# Altium schematic sheet USB3.0_Arria10.SchDoc: USB3.0
size B; DocumentNumber: 28; SheetNumber: 28; SheetTotal: 46
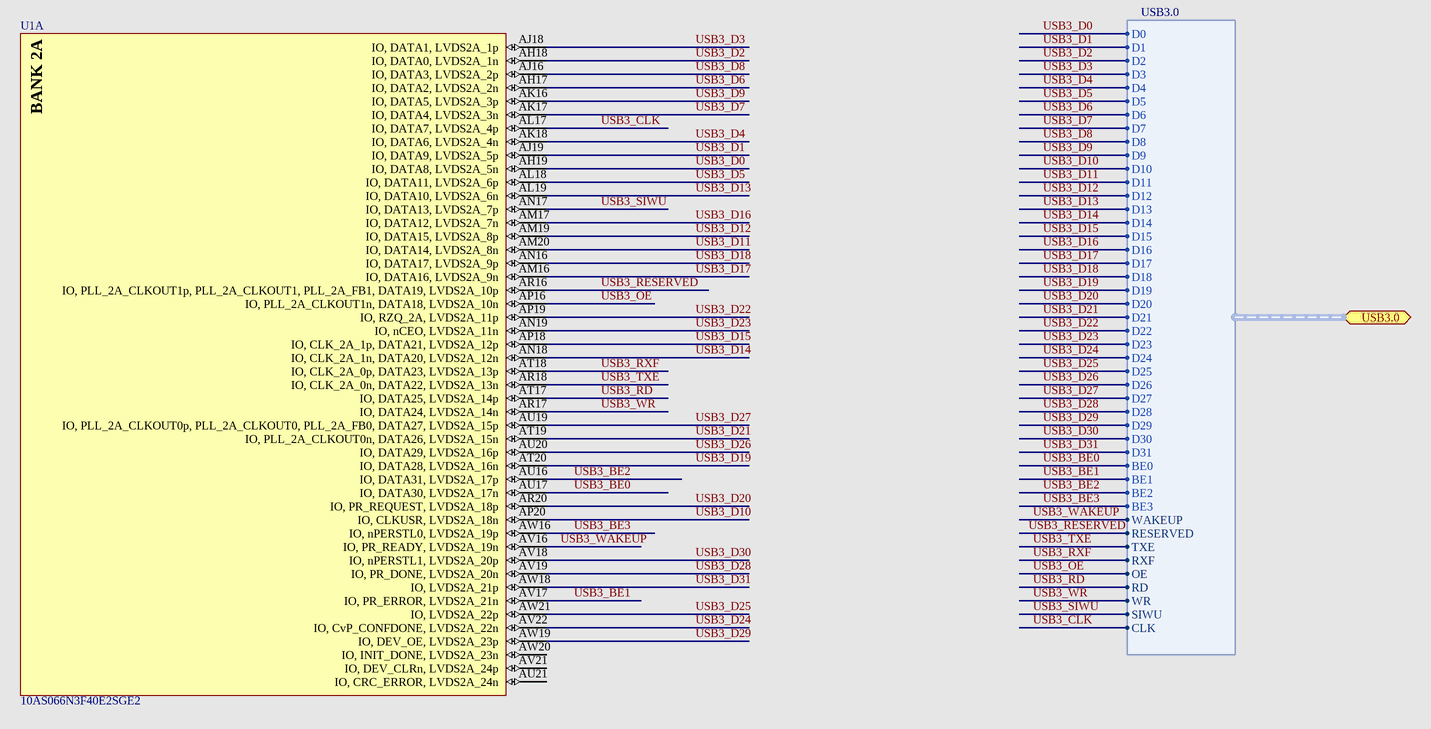
[diagram p0: USB3.0_Arria10.SchDoc]

## Parts
U1  10AS066N3F40E2SGE2  [ALTR-FBGA1517_A-350]  (part A of 31)

## Ports
USB3.0 (harness USB3.0)

## Harnesses
USB3.0: RD, OE, RXF, TXE, RESERVED, WAKEUP, WR, SIWU, CLK, D0, D1, D2, D3, D4, D5, D6, D7, D8, D9, D10, D11, D12, D13, D14, D15, D16, D17, D18, D19, D20, D21, D22, D23, D24, D25, D26, D27, D28, D29, D30, D31, BE0, BE1, BE2, BE3

## Nets
USB3_BE0: U1.AU17(IO,_DATA30,_LVDS2A_17n) ; port USB3.0.BE0
USB3_BE1: U1.AV17(IO,_PR_ERROR,_LVDS2A_21n) ; port USB3.0.BE1
USB3_BE2: U1.AU16(IO,_DATA31,_LVDS2A_17p) ; port USB3.0.BE2
USB3_BE3: U1.AW16(IO,_nPERSTL0,_LVDS2A_19p) ; port USB3.0.BE3
USB3_CLK: U1.AL17(IO,_DATA7,_LVDS2A_4p) ; port USB3.0.CLK
USB3_D0: U1.AH19(IO,_DATA8,_LVDS2A_5n) ; port USB3.0.D0
USB3_D1: U1.AJ19(IO,_DATA9,_LVDS2A_5p) ; port USB3.0.D1
USB3_D2: U1.AH18(IO,_DATA0,_LVDS2A_1n) ; port USB3.0.D2
USB3_D3: U1.AJ18(IO,_DATA1,_LVDS2A_1p) ; port USB3.0.D3
USB3_D4: U1.AK18(IO,_DATA6,_LVDS2A_4n) ; port USB3.0.D4
USB3_D5: U1.AL18(IO,_DATA11,_LVDS2A_6p) ; port USB3.0.D5
USB3_D6: U1.AH17(IO,_DATA2,_LVDS2A_2n) ; port USB3.0.D6
USB3_D7: U1.AK17(IO,_DATA4,_LVDS2A_3n) ; port USB3.0.D7
USB3_D8: U1.AJ16(IO,_DATA3,_LVDS2A_2p) ; port USB3.0.D8
USB3_D9: U1.AK16(IO,_DATA5,_LVDS2A_3p) ; port USB3.0.D9
USB3_D10: U1.AP20(IO,_CLKUSR,_LVDS2A_18n) ; port USB3.0.D10
USB3_D11: U1.AM20(IO,_DATA14,_LVDS2A_8n) ; port USB3.0.D11
USB3_D12: U1.AM19(IO,_DATA15,_LVDS2A_8p) ; port USB3.0.D12
USB3_D13: U1.AL19(IO,_DATA10,_LVDS2A_6n) ; port USB3.0.D13
USB3_D14: U1.AN18(IO,_CLK_2A_1n,_DATA20,_LVDS2A_12n) ; port USB3.0.D14
USB3_D15: U1.AP18(IO,_CLK_2A_1p,_DATA21,_LVDS2A_12p) ; port USB3.0.D15
USB3_D16: U1.AM17(IO,_DATA12,_LVDS2A_7n) ; port USB3.0.D16
USB3_D17: U1.AM16(IO,_DATA16,_LVDS2A_9n) ; port USB3.0.D17
USB3_D18: U1.AN16(IO,_DATA17,_LVDS2A_9p) ; port USB3.0.D18
USB3_D19: U1.AT20(IO,_DATA28,_LVDS2A_16n) ; port USB3.0.D19
USB3_D20: U1.AR20(IO,_PR_REQUEST,_LVDS2A_18p) ; port USB3.0.D20
USB3_D21: U1.AT19(IO,_PLL_2A_CLKOUT0n,_DATA26,_LVDS2A_15n) ; port USB3.0.D21
USB3_D22: U1.AP19(IO,_RZQ_2A,_LVDS2A_11p) ; port USB3.0.D22
USB3_D23: U1.AN19(IO,_nCEO,_LVDS2A_11n) ; port USB3.0.D23
USB3_D24: U1.AV22(IO,_CvP_CONFDONE,_LVDS2A_22n) ; port USB3.0.D24
USB3_D25: U1.AW21(IO,_LVDS2A_22p) ; port USB3.0.D25
USB3_D26: U1.AU20(IO,_DATA29,_LVDS2A_16p) ; port USB3.0.D26
USB3_D27: U1.AU19(IO,_PLL_2A_CLKOUT0p,_PLL_2A_CLKOUT0,_PLL_2A_FB0,_DATA27,_LVDS2A_15p) ; port USB3.0.D27
USB3_D28: U1.AV19(IO,_PR_DONE,_LVDS2A_20n) ; port USB3.0.D28
USB3_D29: U1.AW19(IO,_DEV_OE,_LVDS2A_23p) ; port USB3.0.D29
USB3_D30: U1.AV18(IO,_nPERSTL1,_LVDS2A_20p) ; port USB3.0.D30
USB3_D31: U1.AW18(IO,_LVDS2A_21p) ; port USB3.0.D31
USB3_OE: U1.AP16(IO,_PLL_2A_CLKOUT1n,_DATA18,_LVDS2A_10n) ; port USB3.0.OE
USB3_RD: U1.AT17(IO,_DATA25,_LVDS2A_14p) ; port USB3.0.RD
USB3_RESERVED: U1.AR16(IO,_PLL_2A_CLKOUT1p,_PLL_2A_CLKOUT1,_PLL_2A_FB1,_DATA19,_LVDS2A_10p) ; port USB3.0.RESERVED
USB3_RXF: U1.AT18(IO,_CLK_2A_0p,_DATA23,_LVDS2A_13p) ; port USB3.0.RXF
USB3_SIWU: U1.AN17(IO,_DATA13,_LVDS2A_7p) ; port USB3.0.SIWU
USB3_TXE: U1.AR18(IO,_CLK_2A_0n,_DATA22,_LVDS2A_13n) ; port USB3.0.TXE
USB3_WAKEUP: U1.AV16(IO,_PR_READY,_LVDS2A_19n) ; port USB3.0.WAKEUP
USB3_WR: U1.AR17(IO,_DATA24,_LVDS2A_14n) ; port USB3.0.WR

Not connected (* = marked no-connect by the designer): U1 AU21(IO,_CRC_ERROR,_LVDS2A_24n) AV21(IO,_DEV_CLRn,_LVDS2A_24p) AW20(IO,_INIT_DONE,_LVDS2A_23n)

## Notes on the sheet
- Title
- Size:
- Date:
- B
- Number:
- Time:
- Revision:
- Sheet
- of
- File:
- (in symbol CMP-1689-00006-3, part A) BANK 2A

## Library data of the parts
U1 = CMP-1689-00006-3: Arria 10 SX Family, 588 I/O Pins, 16 Fractional PLLs, 1517-Pin FBGA, Speed Grade 2, Extended Grade, RoHS; ComponentLink3Description: Package Specification; PackageVersion: Rev. 5.0, 01/2016; ComponentLink3URL: https://www.altera.com/content/dam/altera-www/global/en_US/pdfs/literature/packaging/04r00461-04.pdf; ComponentLink2Description: Datasheet; Code_JEDEC: MS-034; Mounting Technology: Surface Mount; PartNumber: 10AS066N3F40E2SGE2; PackageDescription: 1517-Pin FineLine Ball-Grid Array (FBGA), Body 40 x 40 mm, Pitch 1 mm; ComponentLink2URL: https://www.altera.com/content/dam/altera-www/global/en_US/pdfs/literature/hb/arria-10/a10_datasheet.pdf; ComponentLink1URL: https://www.altera.com/; DatasheetVersion: Rev. 2016-06-24, 06/2016; ComponentLink1Description: Manufacturer URL